# EAGLE design oledSpiMono (EAGLE 5.08)
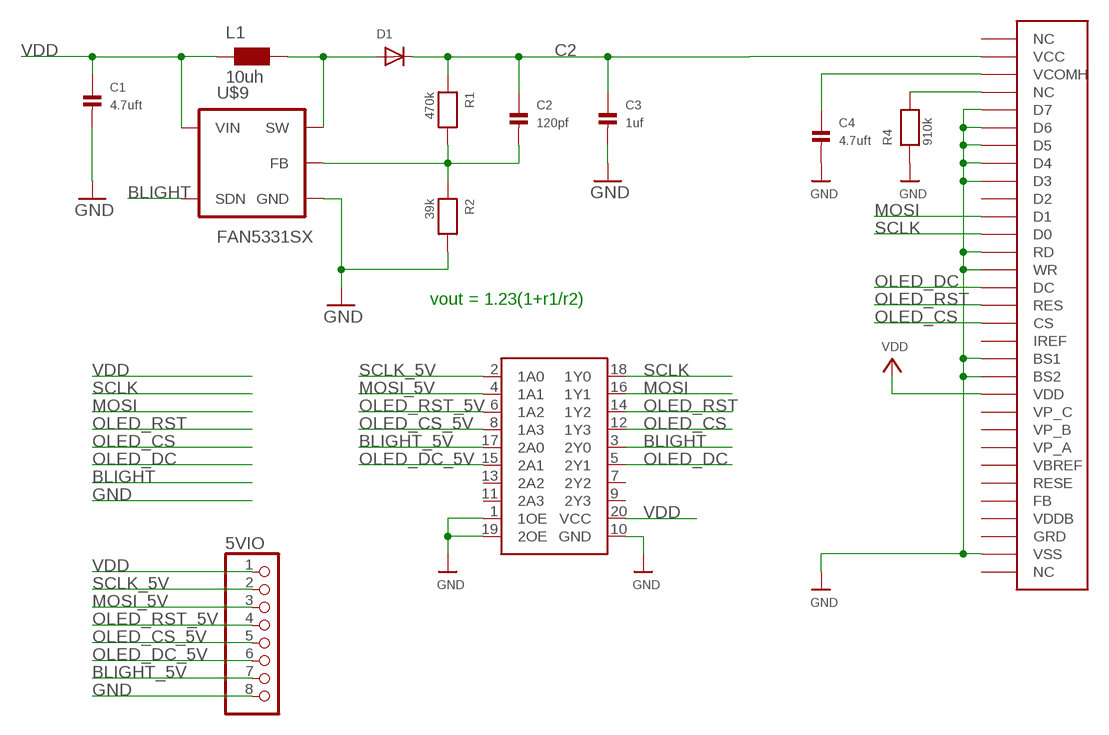
[diagram p0: schematic, sheet 1]

## Parts
5VIO  HEADER-1X8ROUND  [1X08_ROUND]
C1  4.7uft  CAP_CERAMIC0805  [0805]
C2  120pf  CAP_CERAMIC0805  [0805]
C3  1uf  CAP_CERAMIC0805  [0805]
C4  4.7uft  CAP_CERAMIC0805  [0805]
D1  DIODESOD-123  [SOD-123]
L1  10uh  WE-KIHQ_1008  [WE-KI_1008_B]
R1  470k  RESISTOR0805  [0805]
R2  39k  RESISTOR0805  [0805]
R4  910k  RESISTOR0805  [0805]
U$1  OLED104  [OLED12832]
U$2  74LVC244  [TSSOP20]
U$9  FAN5331SX  [SOT23-5]

## Nets
BLIGHT: U$2.3(2Y0) U$9.5(SDN)
BLIGHT_5V: 5VIO.7 U$2.17(2A0)
C2 [power]: C2.1 C3.1 D1.C R1.1 U$1.P$2(VCC)
GND [power]: 5VIO.8 C1.2 C3.2 C4.2 R2.2 R4.1 U$1.P$5(D7) U$1.P$6(D6) U$1.P$7(D5) U$1.P$8(D4) U$1.P$9(D3) U$1.P$13(RD) U$1.P$14(WR) U$1.P$19(BS1) U$1.P$20(BS2) U$1.P$30(VSS) U$2.1(1OE) U$2.10(GND) U$2.19(2OE) U$9.2(GND)
MOSI: U$1.P$11(D1) U$2.16(1Y1)
MOSI_5V: 5VIO.3 U$2.4(1A1)
N$1: D1.A L1.1 U$9.1(SW)
N$2: R4.2 U$1.P$4(NC)
N$5: C2.2 R1.2 R2.1 U$9.3(FB)
N$7: C4.1 U$1.P$3(VCOMH)
OLED_CS: U$1.P$17(CS) U$2.12(1Y3)
OLED_CS_5V: 5VIO.5 U$2.8(1A3)
OLED_DC: U$1.P$15(DC) U$2.5(2Y1)
OLED_DC_5V: 5VIO.6 U$2.15(2A1)
OLED_RST: U$1.P$16(RES) U$2.14(1Y2)
OLED_RST_5V: 5VIO.4 U$2.6(1A2)
SCLK: U$1.P$12(D0) U$2.18(1Y0)
SCLK_5V: 5VIO.2 U$2.2(1A0)
VDD [power]: 5VIO.1 C1.1 L1.2 U$1.P$21(VDD) U$2.20(VCC) U$9.4(VIN)
Unconnected: U$1.P$1(NC) U$1.P$10(D2) U$1.P$18(IREF) U$1.P$22(VP_C) U$1.P$23(VP_B) U$1.P$24(VP_A) U$1.P$25(VBREF) U$1.P$26(RESE) U$1.P$27(FB) U$1.P$28(VDDB) U$1.P$29(GRD) U$1.P$31(NC) U$2.7(2Y2) U$2.9(2Y3) U$2.11(2A3) U$2.13(2A2)

## Notes on the sheet
- vout = 1.23(1+r1/r2)

## Library data of the parts
5VIO = microbuilder:HEADER-1X8: PIN HEADER
C1 = PeterAtMega644:CAP_CERAMIC: Ceramic Capacitors 0603 - 0603 Surface Mount Capacitors 3pF 250V +/-0.1pF RF Ceramic Capacitor[Digikey: 712-1347-1-ND] 16 pF 50V 5% Ceramic Capacitor[Digikey: 445-5051-2-ND] 18 pF 250V 5% RF Ceramic Capcitor [Digikey: 478-3505-1-ND] 22 pF 50V Ceramic Capacitor [Digikey: PCC220ACVTR-ND] 33 pF 50V 5% Ceramic Capacitor 56 pF 250V 5% C0G RF Ceramic Capcitor [Digikey: 490-4867-1-ND] 680 pF 50V Ceramic Capacitor 2200 pF 50V 5% C0G Ceramic Capacitor [Digikey: 445-1297-1-ND] 5600 pF 100V 5% X7R Ceramic Capacitor [Digikey: 478-3711-1-ND] 0.1 µF 25V 10% Ceramic Capacitor [Digikey: PCC2277TR-ND] 0.22 µF 16V 10% X7R Ceramic Capacitor [Digikey: 445-1318-1-ND] 1.0 µF 25V 10% Ceramic Capacitor [Digikey: 445-5146-2-ND] 0805 - 0805 Surface Mount Capacitors 220 pF 250V 2% RF Ceramic Capacitor [Digikey: 712-1398-1-ND] 1000 pF 50V 2% NP0 Ceramic Capacitor [Digikey: 478-3760-1-ND] 0.1 µF 25V 10% Ceramic Capacitor [Digikey: PCC1828TR-ND] 1.0 µF 16V 10% Ceramic Capacitor[Digikey: 490-1691-2-ND] 10.0 µF 10V 10% Ceramic Capacitor[Digikey: 709-1228-1-ND] 1206 - 1206 Surface Mount Capacitors
C2-C4 = microbuilder:CAP_CERAMIC: Ceramic Capacitors 0603 - 0603 Surface Mount Capacitors 3pF 250V +/-0.1pF RF Ceramic Capacitor[Digikey: 712-1347-1-ND] 16 pF 50V 5% Ceramic Capacitor[Digikey: 445-5051-2-ND] 18 pF 250V 5% RF Ceramic Capcitor [Digikey: 478-3505-1-ND] 22 pF 50V Ceramic Capacitor [Digikey: PCC220ACVTR-ND] 33 pF 50V 5% Ceramic Capacitor 56 pF 250V 5% C0G RF Ceramic Capcitor [Digikey: 490-4867-1-ND] 680 pF 50V Ceramic Capacitor 2200 pF 50V 5% C0G Ceramic Capacitor [Digikey: 445-1297-1-ND] 5600 pF 100V 5% X7R Ceramic Capacitor [Digikey: 478-3711-1-ND] 0.1 µF 25V 10% Ceramic Capacitor [Digikey: PCC2277TR-ND] 0.22 µF 16V 10% X7R Ceramic Capacitor [Digikey: 445-1318-1-ND] 1.0 µF 25V 10% Ceramic Capacitor [Digikey: 445-5146-2-ND] 0805 - 0805 Surface Mount Capacitors 220 pF 250V 2% RF Ceramic Capacitor [Digikey: 712-1398-1-ND] 1000 pF 50V 2% NP0 Ceramic Capacitor [Digikey: 478-3760-1-ND] 0.1 µF 25V 10% Ceramic Capacitor [Digikey: PCC1828TR-ND] 1.0 µF 16V 10% Ceramic Capacitor[Digikey: 490-1691-2-ND] 10.0 µF 10V 10% Ceramic Capacitor[Digikey: 709-1228-1-ND] 1206 - 1206 Surface Mount Capacitors
D1 = microbuilder:DIODE: Diode SMADIODE - SMA Surface Mount Package 20V 1A Schottky Diode Digikey: 641-1014-6-ND SOD-123 30V 500mA (430mV Vf) Schottky Diode - Digikey: B0530W-FDICT-ND SOD-323 10V 570mA (380mV Vf, 3ns) Schottky Diode - Digikey: ZLLS410CT-ND SOD-523 30V 30mA Schottky Diode (RB751S-40TE61) - Digikey: RB751S-40TE61CT-ND SOT23-R/W - SOT23 Package (R = Solder Paste/Reflow Ovens, W = Hand-Soldering) BAT54Film 40V 300mA - Digikey: 497-7162-1-ND DO-1N4148 Through Hole Small Current Diode (any model)
L1 = PeterAtMega644:WE-KIHQ: SMD Wire Wound Ceramic Inductor WE-KIHQ - High current - Highest Quality factor in size 0805 - up to 98 - High thermal stability - High SRF -- Bluetooth -- Wireless LAN -- RF oscillation circuit -- IF impedance matching -- IG choke
R1 R2 R4 = PeterAtMega644:RESISTOR: Resistors 0603 - 0603 Surface Mount Package 0 Ohm 1/10 Watt 1% Resistor 15 Ohm 1/10 Watt 1% Resistor 33 Ohm 1/10 Watt 1% Resistor 49.9 Ohm 1/10 Watt 1% Resistor 100 Ohm 1/10 Watt 1% Resistor 150 Ohm 1/10 Watt 1% Resistor 240 Ohm 1/10 Watt 1% Resistor 390 Ohm 1/10 Watt 1% Resistor 560 Ohm 1/10 Watt 1% Resistor 750 Ohm 1/10 Watt 1% Resistor 1.0K Ohm 1/10 Watt 1% Resistor 1.5K Ohm 1/10 Watt 1% Resistor 2.0K Ohm 1/10 Watt 1% Resistor 10.0K Ohm 1/10 Watt 1% Resistor 20.0K Ohm 1/10 Watt 1% Resistor 33.0K Ohm 1/10 Watt 1% Resistor 100.0K Ohm 1/10 Watt 1% Resistor 0805 - 0805 Surface Mount Package 0 Ohm 1/8 Watt 1% Resistor 33 Ohm 1/8 Watt 1% Resistor 100 Ohm 1/8 Watt 1% Resistor 150 Ohm 1/8 Watt 1% Resistor 200 Ohm 1/8 Watt 1% Resistor 240 Ohm 1/8 Watt 1% Resistor 330 Ohm 1/8 Watt 1% Resistor 390 Ohm 1/8 Watt 1% Resistor 470 Ohm 1/8 Watt 1% Resistor 1.0K Ohm 1/8 Watt 1% Resistor 1.5K Ohm 1/8 Watt 1% Resistor 2.0K Ohm 1/8 Watt 1% Resistor 4.7K Ohm 1/8 Watt 1% Resistor 5.1K Ohm 1/8 Watt 1% Resistor 5.6K Ohm 1/8 Watt 1% Resistor 10.0K Ohm 1/8 Watt 1% Resistor 22.0K Ohm 1/8 Watt 1% Resistor 33.0K Ohm 1/8 Watt 1% Resistor 100K Ohm 1/8 Watt 1% Resistor 1206 - 1206 Surface Mount Package
U$1 = PeterAtMega644:OLED104: LG 1.04 Inch OLED
U$2 = PeterAtMega644:74LVC244
U$9 = PeterAtMega644:FAN5331SX: OLED Supply with 20V Integrated Switch

## Net classes
0 default: width 0.152 mm, drill 0.33 mm, clearance 0.152 mm
1 power: width 0.152 mm, drill 0.33 mm, clearance 0.152 mm

## Board
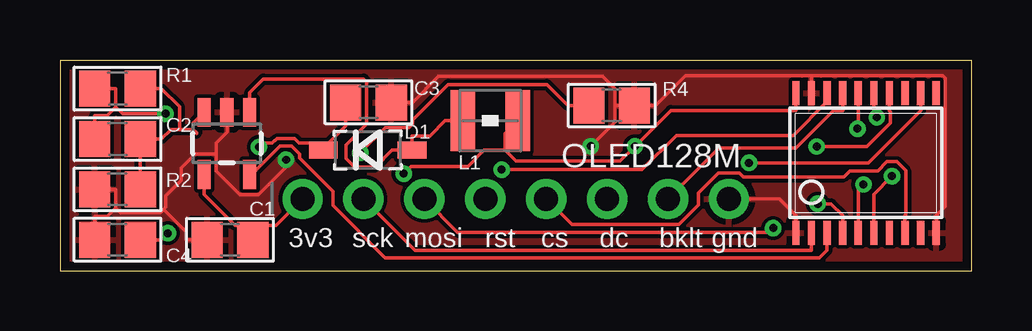
[diagram p1: board, top side]
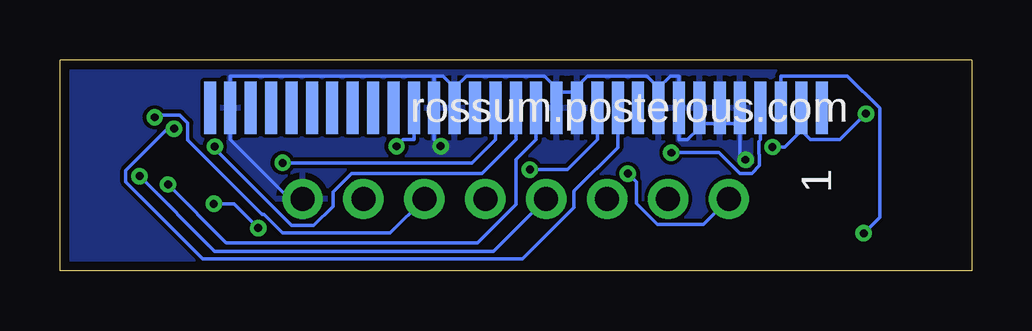
[diagram p2: board, bottom side, seen from below]

Size 38 x 8.8 mm. Coordinates in mm from the lower left corner, seen from the top.
Outline: 0,0 38,0 38,8.8 0,8.8 0,0
Copper layers (1*16): Top 0.0356mm / dielectric 1.5011mm / Bottom 0.0356mm
Design rules "LaenPCBOrder *": minimum track width 6mil, minimum drill 13mil, track to track 6mil, track to pad 6mil, pad to pad 6mil, via to via 6mil, smd to smd 6mil, copper to edge 15mil, drill to drill 6mil, minimum pad ring 7mil, minimum via ring 7mil, stop-mask expansion 4mil, vias tented up to drill 20mil, thermal gap 10mil

### Footprints (pad centres in the part's own frame; a part is rotated, then mirrored left to right if it is on the bottom)
1X08_ROUND = drill 1 pad 1.676 round: 1 -8.89,0; 2 -6.35,0; 3 -3.81,0; 4 -1.27,0; 5 1.27,0; 6 3.81,0; 7 6.35,0; 8 8.89,0
0805 = smd 1.3 x 1.5: 1 -0.95,0; 2 0.95,0
SOD-123 = smd 1.2 x 0.7: A 1.85,0; C -1.85,0
WE-KI_1008_B = smd 1.02 x 2.54: 1 -1.145,0; 2 1.145,0
OLED12832 = smd 2.2 x 0.5: P$1 0,12.75; P$2 0,11.9; P$3 0,11.05; P$4 0,10.2; P$5 0,9.35; P$6 0,8.5; P$7 0,7.65; P$8 0,6.8; P$9 0,5.95; P$10 0,5.1; P$11 0,4.25; P$12 0,3.4; P$13 0,2.55; P$14 0,1.7; P$15 0,0.85; P$16 0,0; P$17 0,-0.85; P$18 0,-1.7; P$19 0,-2.55; P$20 0,-3.4; P$21 0,-4.25; P$22 0,-5.1; P$23 0,-5.95; P$24 0,-6.8; P$25 0,-7.65; P$26 0,-8.5; P$27 0,-9.35; P$28 0,-10.2; P$29 0,-11.05; P$30 0,-11.9; P$31 0,-12.75
TSSOP20 = smd 0.305 x 0.991: 1 -2.925,-2.918; 2 -2.275,-2.918; 3 -1.625,-2.918; 4 -0.975,-2.918; 5 -0.325,-2.918; 6 0.325,-2.918; 7 0.975,-2.918; 8 1.625,-2.918; 9 2.275,-2.918; 10 2.925,-2.918; 11 2.925,2.918; 12 2.275,2.918; 13 1.625,2.918; 14 0.975,2.918; 15 0.325,2.918; 16 -0.325,2.918; 17 -0.975,2.918; 18 -1.625,2.918; 19 -2.275,2.918; 20 -2.925,2.918
SOT23-5 = smd 0.55 x 1.2: 1 -0.95,-1.3; 2 0,-1.3; 3 0.95,-1.3; 4 0.95,1.3; 5 -0.95,1.3

### Placement (x,y rotation side)
5VIO  19,3 0 top
C1  7.09,1.3 180 top
C2  2.4,5.5 0 top
C3  12.86,7.03 0 top
C4  2.4,1.3 180 top
D1  12.83,5.04 0 top
L1  17.95,6.26 0 top
R1  2.4,7.6 0 top
R2  2.4,3.4 180 top
R4  23,6.9 180 top
U$1  19,6.8 270 bottom
U$2  33.6,4.5 0 top
U$9  6.96,5.31 180 top

### Tracks (layer width: path | path; a pad name or v marks a point on that pad's centre or on a via)
BLIGHT
  Top 0.152: U$9.5 7.99,4.01 9.19,5.21 9.66,5.21 9.99,4.87 9.99,4.7 11.38,3.32 11.38,2.72 13.56,0.54 31.66,0.54 31.98,0.86 U$2.3
BLIGHT_5V
  Top 0.152: U$2.17 32.62,6.69 32.25,6.69 30.68,5.12 27.47,5.12 5VIO.7
C2  (via drill 0.33 pad 0.69)
  Top 0.152: 10.94,5.08 10.8,5.22 10.58,5.22 10.47,5.33 9.96,5.33 9.79,5.51 9.06,5.51 8.97,5.43 8.94,5.43 8.85,5.33 8.5,5.33 8.33,5.17 v8.3,5.17 | 10.94,5.08 D1.C | 10.94,5.08 11.91,6.05 C3.1 | 2.33,6.83 2.33,7.6 R1.1 | C2.1 1.45,6.48 1.98,6.48 2.33,6.83 | 2.33,6.83 2.61,6.55 v4.4,6.55
  Bottom 0.152: 7.1,5.86 7.79,5.17 v8.3,5.17 | 7.1,5.86 U$1.P$2 | v4.4,6.55 5.48,5.47 6.71,5.47 7.1,5.86
GND  (via drill 0.33 pad 0.69)
  Top 0.152: C1.2 5.26,1.29 5.26,1.62 4.32,2.56 | v9.42,4.63 9.42,4.33 8.28,3.19 7.49,3.19 6.51,4.16 6.51,4.86 6.5,4.87 | U$9.2 6.96,5.79 6.5,5.33 6.5,4.87 | 6.5,4.87 5.63,4.87 5.05,4.29 5.05,3.77 4.41,3.13 4.41,2.66 4.32,2.56 | C3.2 14.69,7.03 15.79,8.13 22.61,8.13 23.14,7.6 23.14,6.9 | U$2.10 36.52,2.31 36.91,2.69 36.91,8.05 36.81,8.14 31.32,8.14 | U$2.1 30.68,2.31 29.98,3 5VIO.8 | 2.33,2.63 2.54,2.42 4.18,2.42 4.32,2.56 | 31.32,8.14 U$2.19 | 2.33,2.63 2.33,3.4 R2.2 | C4.2 1.45,2.28 1.98,2.28 2.33,2.63 | 23.14,6.9 R4.1 24.83,6.9 26.07,8.14 31.32,8.14 | v22.13,5.2 23.14,6.21 23.14,6.9
  Bottom 0.152: 9.65,6.14 9.65,4.86 v9.42,4.63 | 9.65,6.14 U$1.P$5 | 9.65,6.14 10.5,6.14 | v22.13,5.2 22.4,5.47 U$1.P$20 22.4,8.13 | 10.5,6.14 U$1.P$6 | 5VIO.8 28.43,3 30.9,5.47 U$1.P$30 30.9,8.13 22.4,8.13 | 11.35,6.14 U$1.P$7 | 11.35,6.14 11.35,5.96 11.84,5.47 12.2,5.47 U$1.P$8 12.2,8.13 12.56,8.13 13.05,7.64 | 13.05,7.64 U$1.P$9 | 21.55,7.64 U$1.P$19 | 17.3,7.46 17.3,7.63 17.8,8.13 21.06,8.13 21.55,7.64 | 21.55,7.64 22.04,8.13 22.4,8.13 | 17.3,7.46 U$1.P$14 | 16.45,7.46 17.3,7.46 | 13.05,7.64 13.54,8.13 16.01,8.13 16.45,7.68 16.45,7.46 | 16.45,7.46 U$1.P$13 | 10.5,6.14 11.35,6.14
  pour Top: 0,0 38.4,0 38.4,8.8 0,8.8
  pour Bottom: 0,0 38.4,0 38.4,8.8 0,8.8
MOSI  (via drill 0.33 pad 0.69)
  Top 0.152: v33.24,5.93 33.27,5.96 U$2.16
  Bottom 0.152: U$1.P$11 14.75,5.14 16.57,3.32 16.57,2.65 18.71,0.5 32.05,0.5 35.26,3.71 35.26,4.18 33.51,5.93 v33.24,5.93
MOSI_5V  (via drill 0.33 pad 0.69)
  Top 0.152: U$2.4 32.62,2.31 32.14,2.8 v31.59,2.8 | 5VIO.3 16.58,1.61 29.56,1.61 v29.73,1.78
  Bottom 0.152: v29.73,1.78 30.74,2.8 v31.59,2.8
N$1
  Top 0.152: U$9.1 7.91,7.44 8.47,8 12.66,8 12.79,7.87 12.79,6.11 11.93,5.25 11.93,4.69 12.28,4.34 13.15,4.34 13.85,5.04 D1.A 14.68,5.62 15.42,5.62 16.06,6.26 L1.1
N$2  (via drill 0.33 pad 0.69)
  Top 0.152: v12.52,4.93 13.57,5.98 14.56,5.98 14.69,6.11 14.69,6.28 16.18,7.78 20.3,7.78 21.17,6.9 R4.2
  Bottom 0.152: v12.52,4.93 10.52,4.93 9.66,4.06 9.16,4.06 8.83,4.39 8.83,4.86 8.87,4.89 8.87,5.4 8.8,5.47 U$1.P$4
N$5
  Top 0.152: 5.55,5.9 5.55,6.16 U$9.3 | 5.55,5.9 5.69,5.76 5.69,5.74 | 4.98,5.9 5.55,5.9 | R1.2 4.23,7.6 4.98,6.85 4.98,5.9 | 4.98,5.9 4.63,5.9 4.23,5.5 C2.2 R2.1
N$7  (via drill 0.33 pad 0.69)
  Top 0.152: C4.1 4.23,1.3 v4.5,1.57
  Bottom 0.152: v4.5,1.57 3.83,2.23 3.83,6.79 5.17,8.13 7.95,8.13 U$1.P$3
OLED_CS  (via drill 0.33 pad 0.69)
  Top 0.152: U$2.12 35.88,6.69 33.69,4.51 v28.72,4.51
  Bottom 0.152: U$1.P$17 19.85,5.47 20.82,4.51 v28.72,4.51
OLED_CS_5V
  Top 0.152: U$2.8 35.23,2.31 35.26,2.34 35.26,4.18 34.89,4.55 34.48,4.55 34.1,4.17 32.92,4.17 32.67,3.92 28.48,3.92 28.33,4.07 27.45,4.07 26.62,3.25 26.62,2.75 25.8,1.93 21.34,1.93 5VIO.5
OLED_DC  (via drill 0.33 pad 0.69)
  Top 0.152: v33.49,3.6 33.27,3.38 U$2.5
  Bottom 0.152: U$1.P$15 18.15,5.47 18.98,4.64 18.98,2.77 20.59,1.17 31.06,1.17 v33.49,3.6
OLED_DC_5V  (via drill 0.33 pad 0.69)
  Top 0.152: v34.05,6.41 33.92,6.53 U$2.15
  Bottom 0.152: 5VIO.6 24.23,1.58 28.72,1.58 29.49,2.35 29.57,2.35 32.67,5.46 32.67,6.17 33,6.5 33.96,6.5 v34.05,6.41
OLED_RST  (via drill 0.33 pad 0.69)
  Top 0.152: U$2.14 34.58,6.69 34.62,6.64 34.62,6.17 33.64,5.18 v31.55,5.18
  Bottom 0.152: U$1.P$16 19,5.47 20.4,4.07 25.84,4.07 26.62,3.29 26.62,2.69 27.42,1.88 28.34,1.88 31.55,5.1 v31.55,5.18
OLED_RST_5V  (via drill 0.33 pad 0.69)
  Top 0.152: v34.69,3.95 33.92,3.19 U$2.6
  Bottom 0.152: 5VIO.4 19.92,0.81 31.55,0.81 v34.69,3.95
SCLK  (via drill 0.33 pad 0.69)
  Top 0.152: v18.41,4.22 24.27,4.22 25.69,5.65 30.57,5.65 31.98,7.06 U$2.18
  Bottom 0.152: v18.41,4.22 16.85,4.22 15.6,5.47 U$1.P$12
SCLK_5V
  Top 0.152: U$2.2 31.32,0.86 14.79,0.86 5VIO.2
VDD  (via drill 0.33 pad 0.69)
  Top 0.152: 8.04,1.9 C1.1 | 8.04,1.9 7.29,1.9 6.01,3.19 U$9.4 | 5VIO.1 9.01,1.9 8.04,1.9 | v14.33,4.05 14.63,4.36 17,4.36 17.67,5.03 18.55,5.03 | 18.55,5.03 18.55,5.72 L1.2 | U$2.20 30.68,6.69 25.47,6.69 v23.97,5.2 23.35,4.57 19.01,4.57 18.55,5.03
  Bottom 0.152: v23.97,5.2 23.69,5.47 23.25,5.47 U$1.P$21 | 5VIO.1 11.18,1.93 13.09,1.93 13.98,2.82 13.98,3.7 v14.33,4.05

### Text on the board
tPlace: OLED128M | 3v3 | sck | mosi | rst | cs | dc | bklt | gnd
bPlace: rossum.posterous.com